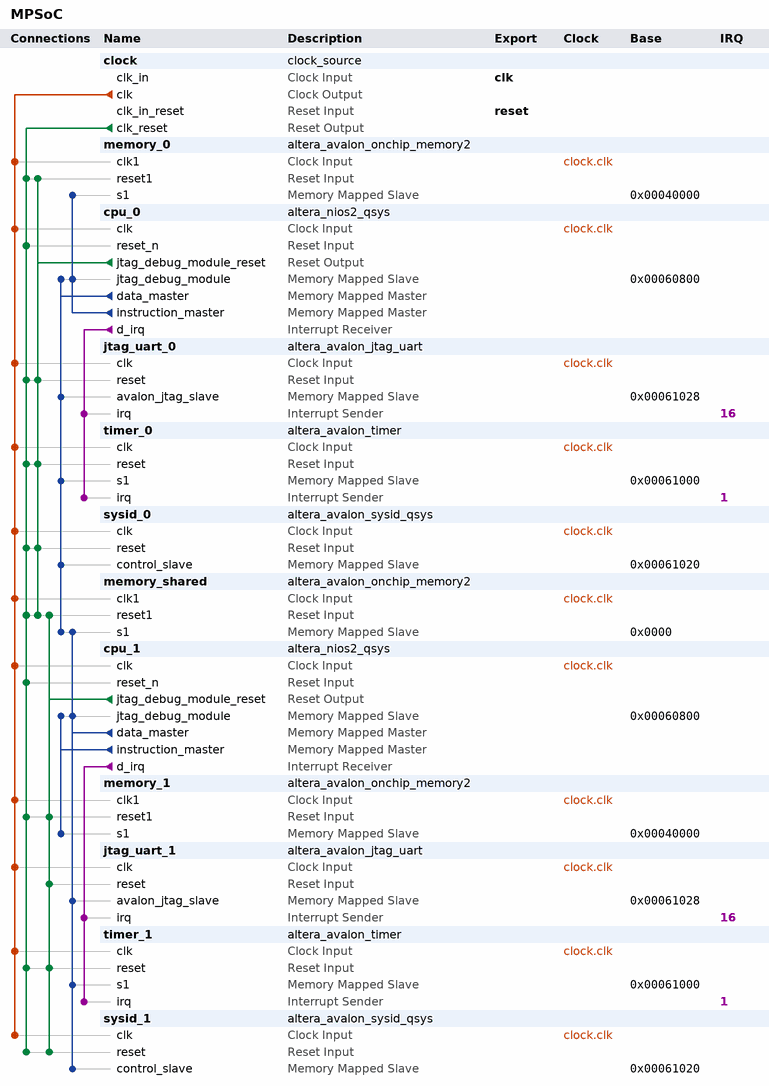
[diagram p0: system contents]
# Platform Designer (Qsys) system MPSoC, Cyclone IV E EP4CE115F29C7
# Parameters at their usual value, and those the tool derives, are not listed.
package require -exact qsys 13.1
create_system MPSoC
set_project_property DEVICE_FAMILY {Cyclone IV E}
set_project_property DEVICE EP4CE115F29C7

add_instance clock clock_source 13.1
set_instance_parameter_value clock clockFrequency 50000000

add_instance memory_0 altera_avalon_onchip_memory2 13.1
set_instance_parameter_value memory_0 dataWidth 32
set_instance_parameter_value memory_0 dualPort false
set_instance_parameter_value memory_0 initMemContent true
set_instance_parameter_value memory_0 initializationFileName onchip_mem.hex
set_instance_parameter_value memory_0 memorySize 102400

add_instance cpu_0 altera_nios2_qsys 13.1
set_instance_parameter_value cpu_0 resetSlave memory_0.s1
set_instance_parameter_value cpu_0 mmu_TLBMissExcSlave None
set_instance_parameter_value cpu_0 exceptionSlave memory_0.s1
set_instance_parameter_value cpu_0 breakSlave cpu_0.jtag_debug_module
set_instance_parameter_value cpu_0 muldiv_multiplierType NoneSmall
set_instance_parameter_value cpu_0 impl Tiny
set_instance_parameter_value cpu_0 icache_size 4096

add_instance jtag_uart_0 altera_avalon_jtag_uart 13.1
set_instance_parameter_value jtag_uart_0 simInteractiveOptions NO_INTERACTIVE_WINDOWS

add_instance timer_0 altera_avalon_timer 13.1
set_instance_parameter_value timer_0 period 1
set_instance_parameter_value timer_0 periodUnits MSEC

add_instance sysid_0 altera_avalon_sysid_qsys 13.1
set_instance_parameter_value sysid_0 id 0

add_instance memory_shared altera_avalon_onchip_memory2 13.1
set_instance_parameter_value memory_shared dataWidth 32
set_instance_parameter_value memory_shared dualPort false
set_instance_parameter_value memory_shared initMemContent true
set_instance_parameter_value memory_shared initializationFileName onchip_mem.hex
set_instance_parameter_value memory_shared memorySize 196608

add_instance cpu_1 altera_nios2_qsys 13.1
set_instance_parameter_value cpu_1 resetSlave memory_1.s1
set_instance_parameter_value cpu_1 mmu_TLBMissExcSlave None
set_instance_parameter_value cpu_1 exceptionSlave memory_1.s1
set_instance_parameter_value cpu_1 breakSlave cpu_1.jtag_debug_module
set_instance_parameter_value cpu_1 muldiv_multiplierType NoneSmall
set_instance_parameter_value cpu_1 impl Tiny
set_instance_parameter_value cpu_1 icache_size 4096

add_instance memory_1 altera_avalon_onchip_memory2 13.1
set_instance_parameter_value memory_1 dataWidth 32
set_instance_parameter_value memory_1 dualPort false
set_instance_parameter_value memory_1 initMemContent true
set_instance_parameter_value memory_1 initializationFileName onchip_mem.hex
set_instance_parameter_value memory_1 memorySize 102400

add_instance jtag_uart_1 altera_avalon_jtag_uart 13.1
set_instance_parameter_value jtag_uart_1 simInteractiveOptions NO_INTERACTIVE_WINDOWS

add_instance timer_1 altera_avalon_timer 13.1
set_instance_parameter_value timer_1 period 1
set_instance_parameter_value timer_1 periodUnits MSEC

add_instance sysid_1 altera_avalon_sysid_qsys 13.1
set_instance_parameter_value sysid_1 id 0

# connections
add_connection clock.clk cpu_0.clk clock
add_connection clock.clk cpu_1.clk clock
add_connection clock.clk jtag_uart_0.clk clock
add_connection clock.clk jtag_uart_1.clk clock
add_connection clock.clk memory_0.clk1 clock
add_connection clock.clk memory_1.clk1 clock
add_connection clock.clk memory_shared.clk1 clock
add_connection clock.clk sysid_0.clk clock
add_connection clock.clk sysid_1.clk clock
add_connection clock.clk timer_0.clk clock
add_connection clock.clk timer_1.clk clock
add_connection clock.clk_reset cpu_0.reset_n reset
add_connection clock.clk_reset cpu_1.reset_n reset
add_connection clock.clk_reset jtag_uart_0.reset reset
add_connection clock.clk_reset memory_0.reset1 reset
add_connection clock.clk_reset memory_1.reset1 reset
add_connection clock.clk_reset memory_shared.reset1 reset
add_connection clock.clk_reset sysid_0.reset reset
add_connection clock.clk_reset sysid_1.reset reset
add_connection clock.clk_reset timer_0.reset reset
add_connection clock.clk_reset timer_1.reset reset
add_connection cpu_0.jtag_debug_module_reset jtag_uart_0.reset reset
add_connection cpu_0.jtag_debug_module_reset memory_0.reset1 reset
add_connection cpu_0.jtag_debug_module_reset memory_shared.reset1 reset
add_connection cpu_0.jtag_debug_module_reset sysid_0.reset reset
add_connection cpu_0.jtag_debug_module_reset timer_0.reset reset
add_connection cpu_1.jtag_debug_module_reset jtag_uart_1.reset reset
add_connection cpu_1.jtag_debug_module_reset memory_1.reset1 reset
add_connection cpu_1.jtag_debug_module_reset memory_shared.reset1 reset
add_connection cpu_1.jtag_debug_module_reset sysid_1.reset reset
add_connection cpu_1.jtag_debug_module_reset timer_1.reset reset
add_connection cpu_0.data_master cpu_0.jtag_debug_module avalon
set_connection_parameter_value cpu_0.data_master/cpu_0.jtag_debug_module baseAddress 0x00060800
add_connection cpu_0.data_master jtag_uart_0.avalon_jtag_slave avalon
set_connection_parameter_value cpu_0.data_master/jtag_uart_0.avalon_jtag_slave baseAddress 0x00061028
add_connection cpu_0.data_master memory_shared.s1 avalon
set_connection_parameter_value cpu_0.data_master/memory_shared.s1 baseAddress 0x0000
add_connection cpu_0.data_master sysid_0.control_slave avalon
set_connection_parameter_value cpu_0.data_master/sysid_0.control_slave baseAddress 0x00061020
add_connection cpu_0.data_master timer_0.s1 avalon
set_connection_parameter_value cpu_0.data_master/timer_0.s1 baseAddress 0x00061000
add_connection cpu_0.instruction_master cpu_0.jtag_debug_module avalon
set_connection_parameter_value cpu_0.instruction_master/cpu_0.jtag_debug_module baseAddress 0x00060800
add_connection cpu_0.instruction_master memory_0.s1 avalon
set_connection_parameter_value cpu_0.instruction_master/memory_0.s1 baseAddress 0x00040000
add_connection cpu_1.data_master cpu_1.jtag_debug_module avalon
set_connection_parameter_value cpu_1.data_master/cpu_1.jtag_debug_module baseAddress 0x00060800
add_connection cpu_1.data_master jtag_uart_1.avalon_jtag_slave avalon
set_connection_parameter_value cpu_1.data_master/jtag_uart_1.avalon_jtag_slave baseAddress 0x00061028
add_connection cpu_1.data_master memory_shared.s1 avalon
set_connection_parameter_value cpu_1.data_master/memory_shared.s1 baseAddress 0x0000
add_connection cpu_1.data_master sysid_1.control_slave avalon
set_connection_parameter_value cpu_1.data_master/sysid_1.control_slave baseAddress 0x00061020
add_connection cpu_1.data_master timer_1.s1 avalon
set_connection_parameter_value cpu_1.data_master/timer_1.s1 baseAddress 0x00061000
add_connection cpu_1.instruction_master cpu_1.jtag_debug_module avalon
set_connection_parameter_value cpu_1.instruction_master/cpu_1.jtag_debug_module baseAddress 0x00060800
add_connection cpu_1.instruction_master memory_1.s1 avalon
set_connection_parameter_value cpu_1.instruction_master/memory_1.s1 baseAddress 0x00040000
add_connection cpu_0.d_irq jtag_uart_0.irq interrupt
set_connection_parameter_value cpu_0.d_irq/jtag_uart_0.irq irqNumber 16
add_connection cpu_0.d_irq timer_0.irq interrupt
set_connection_parameter_value cpu_0.d_irq/timer_0.irq irqNumber 1
add_connection cpu_1.d_irq jtag_uart_1.irq interrupt
set_connection_parameter_value cpu_1.d_irq/jtag_uart_1.irq irqNumber 16
add_connection cpu_1.d_irq timer_1.irq interrupt
set_connection_parameter_value cpu_1.d_irq/timer_1.irq irqNumber 1

# exported interfaces
add_interface reset reset sink
set_interface_property reset EXPORT_OF clock.clk_in_reset
add_interface clk clock sink
set_interface_property clk EXPORT_OF clock.clk_in

set_interconnect_requirement {$system} qsys_mm.clockCrossingAdapter HANDSHAKE
set_interconnect_requirement {$system} qsys_mm.maxAdditionalLatency 1
set_interconnect_requirement {$system} qsys_mm.insertDefaultSlave false

save_system MPSoC.qsys
